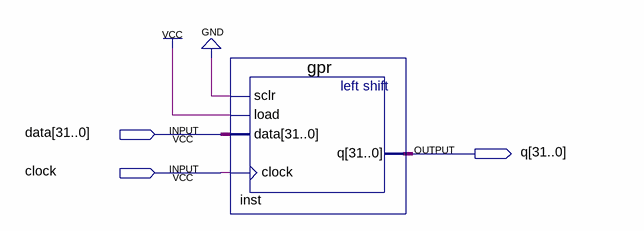
[diagram p0: schematic sheet]
// Quartus schematic SimpleRegister.bdf as structural Verilog: 1 symbols, 3 pins
module SimpleRegister (
  input  [31:0] data,
  input  clock,
  output [31:0] q
);

  gpr inst (.sclr(1'b0), .load(1'b1), .data(data), .clock(clock), .q(q));
endmodule
